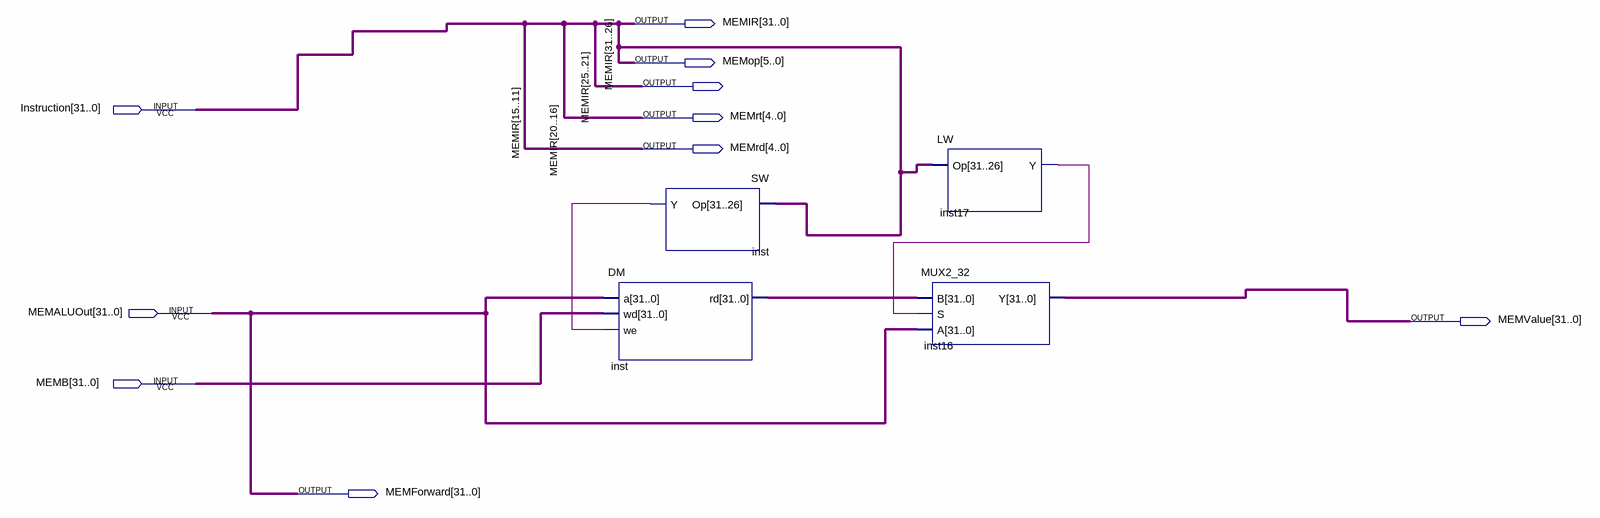
[diagram p0: schematic sheet]
// Quartus schematic MEM.bdf as structural Verilog: 4 symbols, 10 pins
module MEM (
  input  [31:0] Instruction,
  input  [31:0] MEMALUOut,
  input  [31:0] MEMB,
  output [31:0] MEMIR,
  output [5:0] MEMop,
  output [4:0] MEMrt,
  output [4:0] MEMrd,
  output [31:0] MEMValue,
  output [31:0] MEMForward
);

  wire inst17_y, inst_y;
  wire [31:0] inst_rd;

  DM inst (.a(MEMALUOut), .wd(MEMB), .we(inst_y), .rd(inst_rd));
  SW inst_dup2 (.Op(Instruction), .Y(inst_y));
  LW inst17 (.Op(Instruction), .Y(inst17_y));
  MUX2_32 inst16 (.B(inst_rd), .S(inst17_y), .A(MEMALUOut), .Y(MEMValue));

  assign MEMForward = MEMALUOut;
  assign MEMIR = Instruction;
  assign MEMop = Instruction[31:26];
  assign MEMrd = Instruction[15:11];
  assign MEMrt = Instruction[20:16];
endmodule
